# Altium schematic sheet mHealth.SchDoc
size Letter; SheetNumber: 1
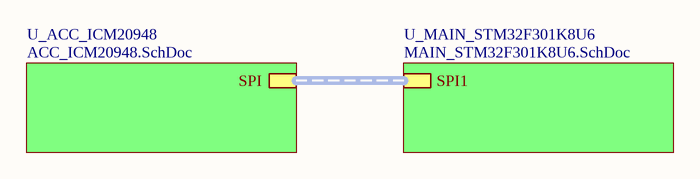
[diagram p0: mHealth.SchDoc]

## Sub-sheets
U_ACC_ICM20948 = ACC_ICM20948.SchDoc: SPI (harness SPI)
U_MAIN_STM32F301K8U6 = MAIN_STM32F301K8U6.SchDoc: SPI1 (harness SPI)

## Buses and harness runs
harness sheet U_ACC_ICM20948/SPI = sheet U_MAIN_STM32F301K8U6/SPI1